# Altium project Dental Sensor - V400.PrjPcb
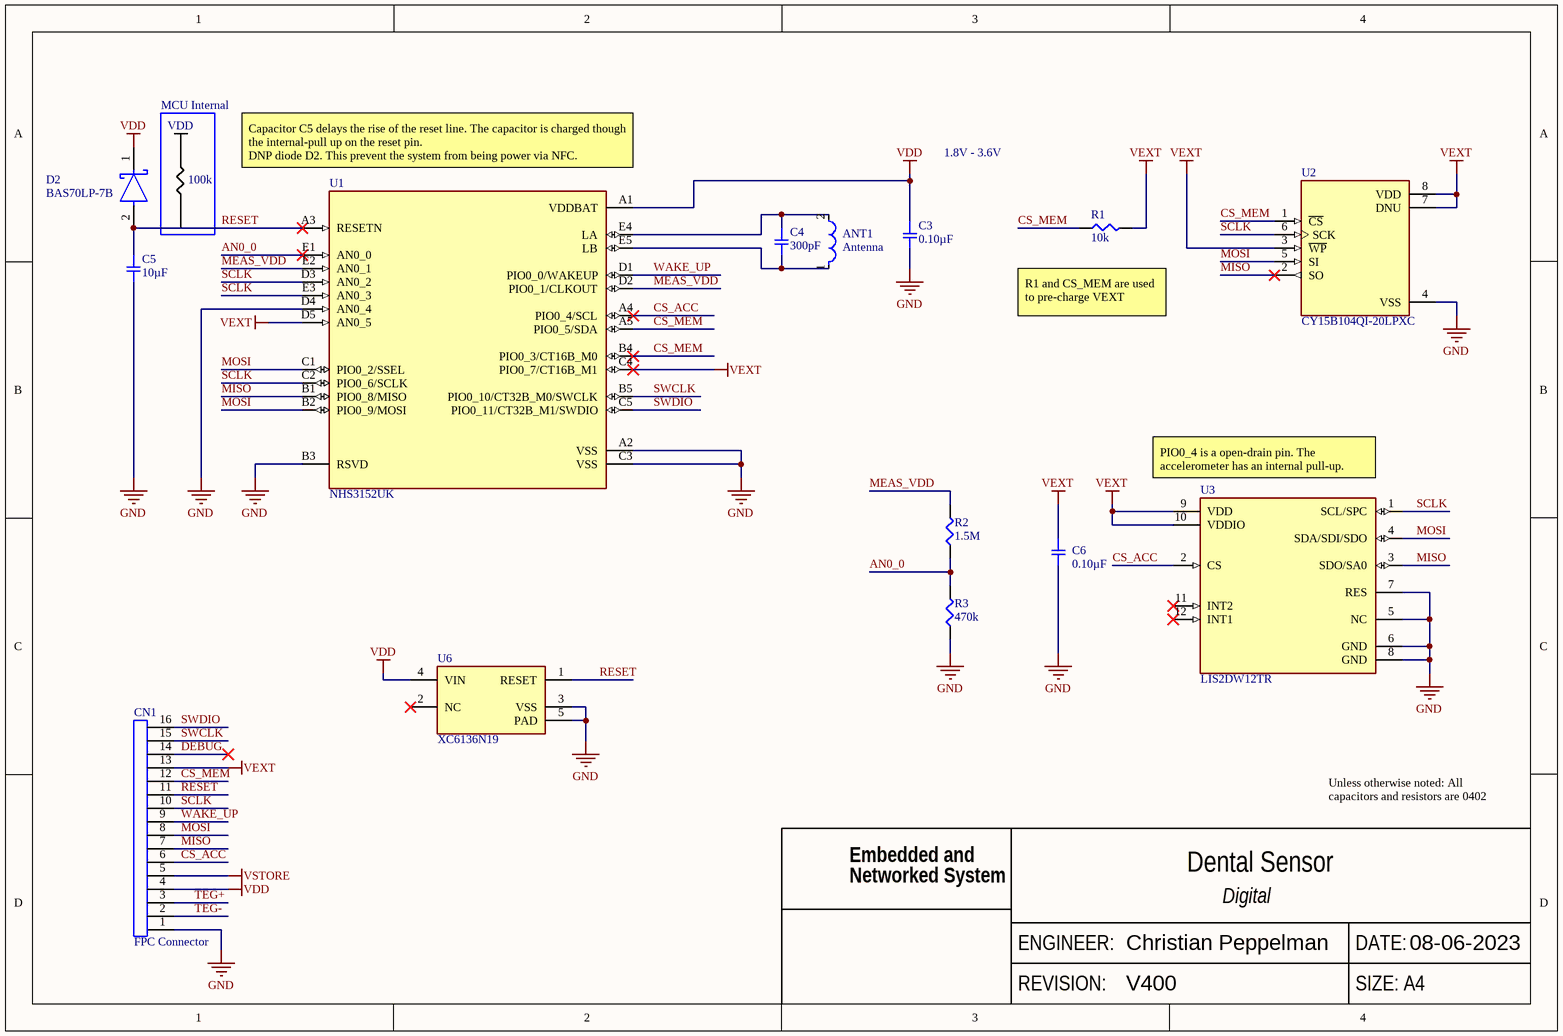
[diagram p0: Digital.SchDoc]
2 sheets, 23 parts. Net scope: global (net labels, ports and power ports of the same name join across sheets).
Board file: Dental Sensor - V400.PcbDoc
Sheets:
  Digital.SchDoc
  Energy Harvesting.SchDoc

## Sheet Digital.SchDoc
size A4; Date: 08-06-2023; Engineer: Christian Peppelman; Revision: V400; SheetNumber: 1; SheetTotal: 2; ProjectSheetName: Dental Sensor; SheetName: Digital

### Parts
ANT1  Antenna  [NFC Antenna]  (net tie, no BOM)
C3  0.10µF  [RESC1005X03N]
C4  300pF  [RESC1005X03N]
C5  10µF  [RESC1005X03N]
C6  0.10µF  [RESC1005X03N]
CN1  FPC Connector  [52745-1697]
D2  BAS70LP-7B  [FP-X1-DFN1006-2-MFG]
R1  10k  [RESC1005X03N]
R2  1.5M  [RESC1005X03N]
R3  470k  [RESC1005X03N]
U1  NHS3152UK  [WLCSP25]
U2  CY15B104QI-20LPXC  [8-GQFN]
U3  LIS2DW12TR  [FP-LGA12-DM00170568-MFG]
U6  XC6136N19  [USPQ-4B05]

### Nets
GND: C3.2 C5.2 C6.2 CN1.1 R3.1 U1.A2(VSS) U1.B3(RSVD) U1.C3(VSS) U1.D4(AN0_4) U2.4(VSS) U3.5(NC) U3.6(GND) U3.7(RES) U3.8(GND) U6.3(VSS) U6.5(PAD)
VDD: C3.1 CN1.4 D2.1(C) U1.A1(VDDBAT) U6.4(VIN)
VEXT: C6.1 CN1.13 R1.2 U1.C4(PIO0_7/CT16B_M1) U1.D5(AN0_5) U2.3(~{WP}) U2.7(DNU) U2.8(VDD) U3.9(VDD) U3.10(VDDIO)
VSTORE: CN1.5
AN0_0: R2.1 R3.2 U1.E1(AN0_0)
CS_ACC: CN1.6 U1.A4(PIO0_4/SCL) U3.2(CS)
CS_MEM: CN1.12 R1.1 U1.A5(PIO0_5/SDA) U1.B4(PIO0_3/CT16B_M0) U2.1(~{CS})
DEBUG: CN1.14
MEAS_VDD: R2.2 U1.D2(PIO0_1/CLKOUT) U1.E2(AN0_1)
MISO: CN1.7 U1.B1(PIO0_8/MISO) U2.2(SO) U3.3(SDO/SA0)
MOSI: CN1.8 U1.B2(PIO0_9/MOSI) U1.C1(PIO0_2/SSEL) U2.5(SI) U3.4(SDA/SDI/SDO)
RESET: C5.1 CN1.11 D2.2(A) U1.A3(RESETN) U6.1(RESET)
SCLK: CN1.10 U1.C2(PIO0_6/SCLK) U1.D3(AN0_2) U1.E3(AN0_3) U2.6(SCK) U3.1(SCL/SPC)
SWCLK: CN1.15 U1.B5(PIO0_10/CT32B_M0/SWCLK)
SWDIO: CN1.16 U1.C5(PIO0_11/CT32B_M1/SWDIO)
TEG+: CN1.3
TEG-: CN1.2
WAKE_UP: CN1.9 U1.D1(PIO0_0/WAKEUP)
NetANT1_1: ANT1.1 C4.2 U1.E5(LB)
NetANT1_2: ANT1.2 C4.1 U1.E4(LA)

Not connected (* = marked no-connect by the designer): U3 11(INT2)* 12(INT1)*; U6 2(NC)*

### Notes on the sheet
- MCU Internal
- (near D2) VDD
- (near U1) Capacitor C5 delays the rise of the reset line. The capacitor is charged though the internal-pull up on the reset pin.
  DNP diode D2. This prevent the system from being power via NFC.
- 1.8V - 3.6V
- 100k
- (near R1) R1 and CS_MEM are used to pre-charge VEXT
- (near U3) PIO0_4 is a open-drain pin. The accelerometer has an internal pull-up.
- Unless otherwise noted: All capacitors and resistors are 0402
- Embedded and
- Networked System
- ENGINEER:
- DATE:
- REVISION:
- SIZE: A4

### Library data of the parts
ANT1 = NFC Antenna: Track 0.2; Gap 0.1; Height 4.6; Width 14.5;
C3 C6 = GRM155R60J104KA01D: CAP CER 0.1UF 6.3V X5R 0402; Manufacturer: Murata Electronics North America; Factory Stock: 0; Unit Price (USD): 0.1; Minimum Quantity: 1; Tolerance: ±10%; Datasheets: http://www.murata.com/~/media/webrenewal/support/library/catalog/products/capacitor/mlcc/c02e.pdf; Image: //media.digikey.com/Renders/Murata%20Renders/ZRB-SERIES-0402.jpg; Digi-Key Part Number: 490-6287-1-ND; Part Number: GRM155R60J104KA01D; Quantity Available: 356062; @ qty: 0; Packaging: Cut Tape (CT); Series: GRM; Part Status: Active; Value: 0.10µF; Voltage: 6.3V; Temperature Coefficient: X5R; Operating Temperature: -55°C ~ 85°C; Features: -; Ratings: -; Applications: General Purpose; Mounting Type: Surface Mount, MLCC; Package / Case: 0402 (1005 Metric); Size / Dimension: 0.039" L x 0.020" W (1.00mm x 0.50mm); Height - Seated (Max): -; Thickness (Max): 0.022" (0.55mm); Lead Spacing: -
C4 = GRM1555C1H301JA01D: CAP CER 300PF 50V NP0 0402; Manufacturer: Murata Electronics North America; Factory Stock: 0; Unit Price (USD): 0.1; Minimum Quantity: 1; Tolerance: ±5%; Temperature Coefficient: C0G, NP0; Datasheets: http://www.murata.com/~/media/webrenewal/support/library/catalog/products/capacitor/mlcc/c02e.pdf; Image: //media.digikey.com/Renders/Murata%20Renders/ZRB-SERIES-0402.jpg; Digi-Key Part Number: 490-3234-1-ND; Part Number: GRM1555C1H301JA01D; Quantity Available: 73694; @ qty: 0; Packaging: Cut Tape (CT); Series: GRM; Part Status: Active; Value: 300pF; Voltage: 50V; Operating Temperature: -55°C ~ 125°C; Features: -; Ratings: -; Applications: General Purpose; Mounting Type: Surface Mount, MLCC; Package / Case: 0402 (1005 Metric); Size / Dimension: 0.039" L x 0.020" W (1.00mm x 0.50mm); Height - Seated (Max): -; Thickness (Max): 0.022" (0.55mm); Lead Spacing: -; Lead Style: -
C5 = GRJ155R60J106ME11D: CAP CER 10UF 6.3V X5R 0402; Manufacturer: Murata Electronics North America; Factory Stock: 0; Unit Price (USD): 0.23; Minimum Quantity: 1; Tolerance: ±20%; Datasheets: http://psearch.en.murata.com/capacitor/product/GRJ155R60J106ME11%23.pdf; Image: //media.digikey.com/Renders/Murata%20Renders/ZRB-SERIES-0402.jpg; Digi-Key Part Number: 490-13211-1-ND; Part Number: GRJ155R60J106ME11D; Quantity Available: 64064; @ qty: 0; Packaging: Cut Tape (CT); Series: GRJ; Part Status: Active; Value: 10µF; Voltage: 6.3V; Temperature Coefficient: X5R; Operating Temperature: -55°C ~ 85°C; Features: Derating Recommended, Soft Termination; Ratings: -; Applications: Boardflex Sensitive; Mounting Type: Surface Mount, MLCC; Package / Case: 0402 (1005 Metric); Size / Dimension: 0.039" L x 0.020" W (1.00mm x 0.50mm); Height - Seated (Max): -; Thickness (Max): 0.028" (0.70mm); Lead Spacing: -; Lead Style: -
CN1 = 52745-1697: FFC / FPC Board Connector, 0.5 mm, 16 Contacts, Receptacle, Easy-On 52745, Surface Mount, Top
D2 = CMP-12790-000002-1: DIODE SCHTTKY 70V 70MA X1DFN1006; Manufacturer: Diodes Inc.; Max Surge Forward Current: 800mA; Capacitance: 1pF; Value: 1pF; Max Junction Temp: +150°C; Standoff Height: 0mm; Peak Reverse Current: 0.1uA; Temperature: -65°C to +150°C; Temperature Range High: +150°C; Automotive: No; Category: Diode; Max Repetitive Reverse Voltage: 70V; Digikey Description: DIODE SCHTTKY 70V 70MA X1DFN1006; Device Class L1: Discrete Semiconductors; Lead Free: Yes; Footprint Url: https://www.diodes.com/assets/Package-Files/X1-DFN1006-2.pdf; Temperature Range Low: -65°C; Reverse Voltage: 70V; Forward Current: 70mA; Package: X1-DFN1006-2; RoHS: TRUE; Manufacturer Part Number: BAS70LP-7B; Height: 0.53mm; Octopart: https://octopart.com/bas70lp-7b-diodes+inc.-22053921; Device Class L3: Schottky Diodes; ComponentLink2URL: https://www.diodes.com/assets/Datasheets/BAS70LP.pdf; ComponentLink2Description: Datasheet; Mouser Description: Schottky Diodes & Rectifiers Schottky Diode; Device Class L2: Diodes
R1 = ERJ-2GEJ103X: RES SMD 10K OHM 5% 1/10W 0402; Manufacturer: Panasonic Electronic Components; Factory Stock: 0; Unit Price (USD): 0.00350; @ qty: 1500; Minimum Quantity: 1; Power (Watts): 0.1W, 1/10W; Temperature Coefficient: ±200ppm/°C; Part Number: ERJ-2GEJ103X; Datasheets: http://industrial.panasonic.com/www-cgi/jvcr13pz.cgi?E+PZ+3+AOA0001+ERJ2GEJ103X+7+WW; Image: //media.digikey.com/Photos/Panasonic%20Photos/ERJ-PA2-Series.jpg; Digi-Key Part Number: P10KJCT-ND; Quantity Available: 2560215; Packaging: Cut Tape (CT); Series: ERJ; Part Status: Active; Value: 10k; Tolerance: ±5%; Composition: Thick Film; Features: Automotive AEC-Q200; Operating Temperature: -55°C ~ 155°C; Package / Case: 0402 (1005 Metric); Supplier Device Package: 0402; Size / Dimension: 0.039" L x 0.020" W (1.00mm x 0.50mm); Height - Seated (Max): 0.016" (0.40mm); Number of Terminations: 2; Failure Rate: -
R2 = ERJ-2GEJ155X: RES SMD 1.5M OHM 5% 1/10W 0402; Manufacturer: Panasonic Electronic Components; Factory Stock: 0; Unit Price (USD): 0.00350; @ qty: 1500; Minimum Quantity: 1; Power (Watts): 0.1W, 1/10W; Temperature Coefficient: -400/ +150ppm/°C; Part Number: ERJ-2GEJ155X; Datasheets: http://industrial.panasonic.com/www-cgi/jvcr13pz.cgi?E+PZ+3+AOA0001+ERJ2GEJ155X+7+WW; Image: //media.digikey.com/Photos/Panasonic%20Photos/ERJ-PA2-Series.jpg; Digi-Key Part Number: P1.5MJCT-ND; Quantity Available: 39239; Packaging: Cut Tape (CT); Series: ERJ; Part Status: Active; Value: 1.5M; Tolerance: ±5%; Composition: Thick Film; Features: Automotive AEC-Q200; Operating Temperature: -55°C ~ 155°C; Package / Case: 0402 (1005 Metric); Supplier Device Package: 0402; Size / Dimension: 0.039" L x 0.020" W (1.00mm x 0.50mm); Height - Seated (Max): 0.016" (0.40mm); Number of Terminations: 2; Failure Rate: -
R3 = ERJ-2RKF4703X: RES SMD 470K OHM 1% 1/10W 0402; Manufacturer: Panasonic Electronic Components; Factory Stock: 0; Unit Price (USD): 0.00496; @ qty: 1500; Minimum Quantity: 1; Power (Watts): 0.1W, 1/10W; Temperature Coefficient: ±100ppm/°C; Part Number: ERJ-2RKF4703X; Datasheets: http://industrial.panasonic.com/www-cgi/jvcr13pz.cgi?E+PZ+3+AOA0002+ERJ2RKF4703X+7+WW; Image: //media.digikey.com/Photos/Panasonic%20Photos/ERJ-PA2-Series.jpg; Digi-Key Part Number: P470KLCT-ND; Quantity Available: 171557; Packaging: Cut Tape (CT); Series: ERJ; Part Status: Active; Value: 470k; Tolerance: ±1%; Composition: Thick Film; Features: Automotive AEC-Q200; Operating Temperature: -55°C ~ 155°C; Package / Case: 0402 (1005 Metric); Supplier Device Package: 0402; Size / Dimension: 0.039" L x 0.020" W (1.00mm x 0.50mm); Height - Seated (Max): 0.016" (0.40mm); Number of Terminations: 2; Failure Rate: -
U1 = NHS3152UK: ARM-microcontrollers - MCU NTAG NHS3152 NFC
U2 = CY15B104QI-20LPXC: FRAM (Ferroelectric RAM) Memory IC 4Mbit SPI 20 MHz 8-GQFN (3.23x3.28)
U3 = CMP-12175-000006-1: ACCEL 2-16G I2C/SPI 12LGA; Manufacturer: STMicroelectronics; Min Supply Voltage: 1.62V; Operating Supply Current: 0.38-90uA; Sensor Output: I2C,SPI; Accel Resolution: 14bits; Max Supply Voltage: 3.6V; Accel Range: 2/4/8/16g; Height: 0.7mm; Device Class L1: Sensors; RoHS: TRUE; Temperature Range Low: -40°C; Category: IC; Mouser Description: Accelerometer Triple ±2g/±4g/±8g/±16g 1.62V to 3.6V 0.244mg/digit/0.488mg/digit/0.976mg/digit/1.952mg/digit 12-Pin LG...; Digikey Description: ACCEL 2-16G I2C/SPI 12LGA; ComponentLink2URL: https://www.st.com/resource/en/datasheet/lis2dw12.pdf; Automotive: No; Manufacturer Part Number: LIS2DW12TR; Lead Free: Yes; Footprint Url: https://www.st.com/content/ccc/resource/technical/document/technical_note/73/17/9c/16/dd/96/4a/01/CD00134799.pdf/files/CD00134799.pdf/jcr:content/translations/en.CD00134799.pdf; Temperature: -40°C to +85°C; Device Class L3: Accelerometers; Package: LGA12-DM00170568; Temperature Range High: +85°C; Device Class L2: Motion Sensors; Octopart: https://octopart.com/lis2dw12tr-stmicroelectronics-77080925; ComponentLink2Description: Datasheet
U6 = XC6136C19ANR-G: Controlecircuits Ultra-Low Power (88nA) Voltage Detector

## Sheet Energy Harvesting.SchDoc
size A4; Date: 08-06-2023; Engineer: Christian Peppelman; Revision: V400; SheetNumber: 2; SheetTotal: 2; ProjectSheetName: Dental Sensor; SheetName: Energy Harvesting
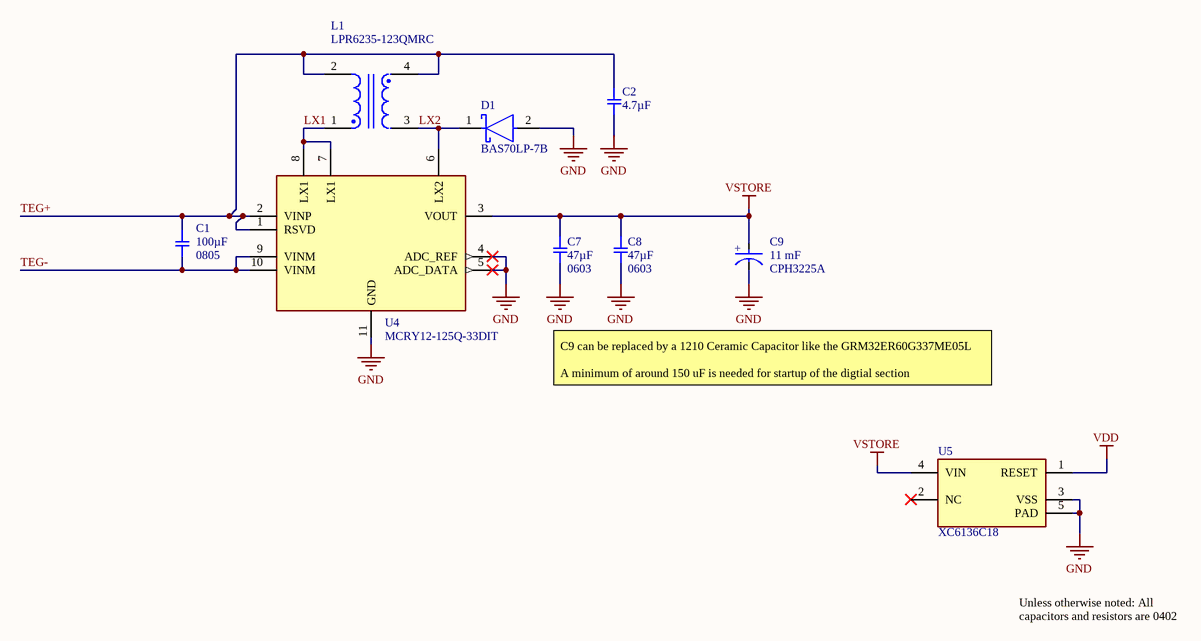
[diagram p1: Energy Harvesting.SchDoc]

### Parts
C1  100µF  Package / Case: 0805  [CAPC2012X12N]
C2  4.7µF  [RESC1005X03N]
C7  47µF  Package / Case: 0603  [CAPC1608X12N]
C8  47µF  Package / Case: 0603  [CAPC1608X12N]
C9  CPH3225A  Capacity: 11 mF  [CPH3225A]
D1  BAS70LP-7B  [FP-X1-DFN1006-2-MFG]
L1  LPR6235-123QMRC  [LPR6235]
U4  MCRY12-125Q-33DIT  [10DFN]
U5  XC6136C18  [USPQ-4B05]

### Nets
GND: C2.2 C7.2 C8.2 C9.2(A) D1.2(A) U4.4(ADC_REF) U4.5(ADC_DATA) U4.11(GND) U5.3(VSS) U5.5(PAD)
VDD: U5.1(RESET)
VSTORE: C7.1 C8.1 C9.1(C) U4.3(VOUT) U5.4(VIN)
LX1: L1.1 U4.7(LX1) U4.8(LX1)
LX2: D1.1(C) L1.3 U4.6(LX2)
TEG+: C1.1 C2.1 L1.2 L1.4 U4.1(RSVD) U4.2(VINP)
TEG-: C1.2 U4.9(VINM) U4.10(VINM)

Not connected (* = marked no-connect by the designer): U5 2(NC)*

### Notes on the sheet
- C9 can be replaced by a 1210 Ceramic Capacitor like the GRM32ER60G337ME05L
  A minimum of around 150 uF is needed for startup of the digtial section
- Unless otherwise noted: All capacitors and resistors are 0402
- Embedded and
- Networked System
- ENGINEER:
- DATE:
- REVISION:
- SIZE: A4
- (in symbol CPH3225A) +

### Library data of the parts
C1 = GRM21BC80E107ME15L: CAP CER 100UF 2.5V X6S 0805; Manufacturer: Murata Electronics North America; Factory Stock: 0; Unit Price (USD): 2.17; Minimum Quantity: 1; Tolerance: ±20%; Datasheets: http://search.murata.co.jp/Ceramy/image/img/A01X/G101/ENG/GRM21BC80E107ME15-01.pdf; Image: //media.digikey.com/Renders/Murata%20Renders/0805%20(2012%20Metric)%20.85mm.jpg; Digi-Key Part Number: 490-13977-1-ND; Part Number: GRM21BC80E107ME15L; Quantity Available: 5990; @ qty: 0; Packaging: Cut Tape (CT); Series: GRM; Part Status: Active; Value: 100µF; Voltage: 2.5V; Temperature Coefficient: X6S; Operating Temperature: -55°C ~ 105°C; Features: -; Ratings: -; Applications: General Purpose; Mounting Type: Surface Mount, MLCC; Size / Dimension: 0.079" L x 0.049" W (2.00mm x 1.25mm); Height - Seated (Max): -; Thickness (Max): 0.057" (1.45mm); Lead Spacing: -; Lead Style: -
C2 = GRM155R60J475ME87D: CAP CER 4.7UF 6.3V X5R 0402; Manufacturer: Murata Electronics North America; Factory Stock: 0; Unit Price (USD): 0.14; Minimum Quantity: 1; Tolerance: ±20%; Datasheets: http://www.murata.com/~/media/webrenewal/support/library/catalog/products/capacitor/mlcc/c02e.pdf; Image: //media.digikey.com/Renders/Murata%20Renders/ZRB-SERIES-0402.jpg; Digi-Key Part Number: 490-5408-1-ND; Part Number: GRM155R60J475ME87D; Quantity Available: 226483; @ qty: 0; Packaging: Cut Tape (CT); Series: GRM; Part Status: Active; Value: 4.7µF; Voltage: 6.3V; Temperature Coefficient: X5R; Operating Temperature: -55°C ~ 85°C; Features: Derating Recommended; Ratings: -; Applications: General Purpose; Mounting Type: Surface Mount, MLCC; Package / Case: 0402 (1005 Metric); Size / Dimension: 0.039" L x 0.020" W (1.00mm x 0.50mm); Height - Seated (Max): -; Thickness (Max): 0.022" (0.55mm); Lead Spacing: -; Lead Style: -
C7 C8 = GRJ155R60J106ME11D: CAP CER 47UF 6.3V X5R 0603; Manufacturer: Murata Electronics North America; Factory Stock: 0; Unit Price (USD): 0.23; Minimum Quantity: 1; Tolerance: ±20%; Datasheets: http://psearch.en.murata.com/capacitor/product/GRJ155R60J106ME11%23.pdf; Image: //media.digikey.com/Renders/Murata%20Renders/ZRB-SERIES-0402.jpg; Digi-Key Part Number: 490-13211-1-ND; Part Number: GRJ155R60J106ME11D; Quantity Available: 64064; @ qty: 0; Packaging: Cut Tape (CT); Series: GRJ; Part Status: Active; Value: 47µF; Voltage: 6.3V; Temperature Coefficient: X5R; Operating Temperature: -55°C ~ 85°C; Features: Derating Recommended, Soft Termination; Ratings: -; Applications: Boardflex Sensitive; Mounting Type: Surface Mount, MLCC; Size / Dimension: 0.039" L x 0.020" W (1.00mm x 0.50mm); Height - Seated (Max): -; Thickness (Max): 0.028" (0.70mm); Lead Spacing: -; Lead Style: -
C9 = CPH3225A: Supercapacitors / Ultracapacitors Reflow EDLC 3.3V, 11mF, 160 Ohm
D1 = CMP-12790-000002-1: as D2 on sheet Digital; Temperature: -65°C to +150°C; Temperature Range High: +150°C; Automotive: No; Category: Diode; Max Repetitive Reverse Voltage: 70V; Digikey Description: DIODE SCHTTKY 70V 70MA X1DFN1006; Device Class L1: Discrete Semiconductors; Lead Free: Yes; Footprint Url: https://www.diodes.com/assets/Package-Files/X1-DFN1006-2.pdf; Temperature Range Low: -65°C; Reverse Voltage: 70V; Forward Current: 70mA; Package: X1-DFN1006-2; RoHS: TRUE; Manufacturer Part Number: BAS70LP-7B; Height: 0.53mm; Octopart: https://octopart.com/bas70lp-7b-diodes+inc.-22053921; Device Class L3: Schottky Diodes; ComponentLink2URL: https://www.diodes.com/assets/Datasheets/BAS70LP.pdf; ComponentLink2Description: Datasheet; Mouser Description: Schottky Diodes & Rectifiers Schottky Diode; Device Class L2: Diodes
L1 = LPR6235-123QMRC: Gekoppelde smoorspoelen 12.5uH 12% 900mA 200 Ohms
U4 = MCRY12: Matrix Mercury Energy Harvesting Synchronous Boost Converter with Microwatt Cold-Start, Input Impedance Matching and Regulated Output
U5 = XC6136N18A9R-G: Controlecircuits Ultra-Low Power (88nA) Voltage Detector

## Nets that join several sheets
GND: Digital (16 pins), Energy Harvesting (10 pins)
VDD: Digital (5 pins), Energy Harvesting (U5.1)
VSTORE: Digital (CN1.5), Energy Harvesting (5 pins)
TEG+: Digital (CN1.3), Energy Harvesting (6 pins)
TEG-: Digital (CN1.2), Energy Harvesting (C1.2 U4.9 U4.10)

## Assembly variants
Default: not fitted C9 D2 U6